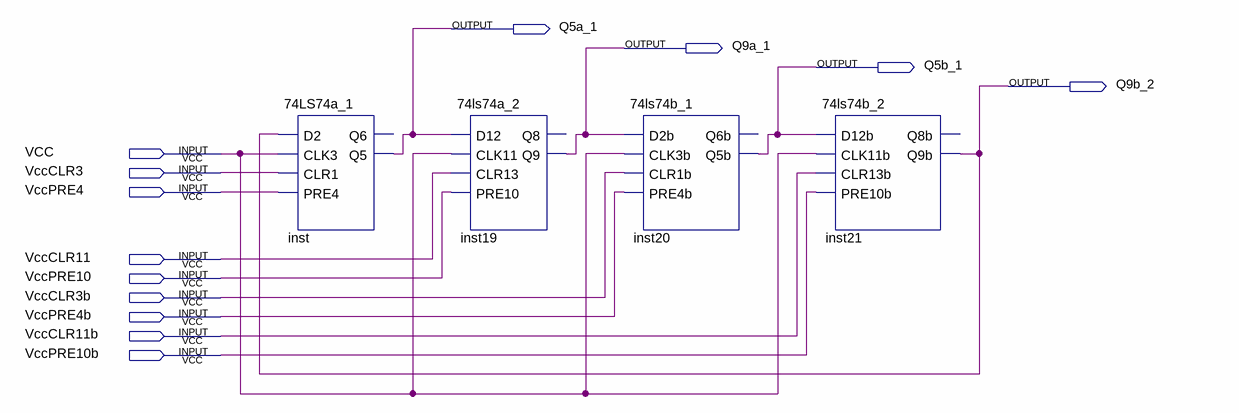
[diagram p0: schematic sheet]
// Quartus schematic 74ls.bdf as structural Verilog: 4 symbols, 13 pins
module \74ls  (
  input  VCC,
  input  VccCLR3,
  input  VccPRE4,
  input  VccCLR11,
  input  VccPRE10,
  input  VccCLR3b,
  input  VccPRE4b,
  input  VccCLR11b,
  input  VccPRE10b,
  output Q5a_1,
  output Q9a_1,
  output Q5b_1,
  output Q9b_2
);

  \74LS74a_1  inst (.D2(Q9b_2), .CLK3(VCC), .CLR1(VccCLR3), .PRE4(VccPRE4), .Q5(Q5a_1));  // open: Q6
  \74ls74a_2  inst19 (.D12(Q5a_1), .CLK11(VCC), .CLR13(VccCLR11), .PRE10(VccPRE10), .Q9(Q9a_1));  // open: Q8
  \74ls74b_1  inst20 (.D2b(Q9a_1), .CLK3b(VCC), .CLR1b(VccCLR3b), .PRE4b(VccPRE4b), .Q5b(Q5b_1));  // open: Q6b
  \74ls74b_2  inst21 (.D12b(Q5b_1), .CLK11b(VCC), .CLR13b(VccCLR11b), .PRE10b(VccPRE10b), .Q9b(Q9b_2));  // open: Q8b
endmodule
